# Altium project Fall22 Universal PCB Rev.2.PrjPcb (part 2 of 2)
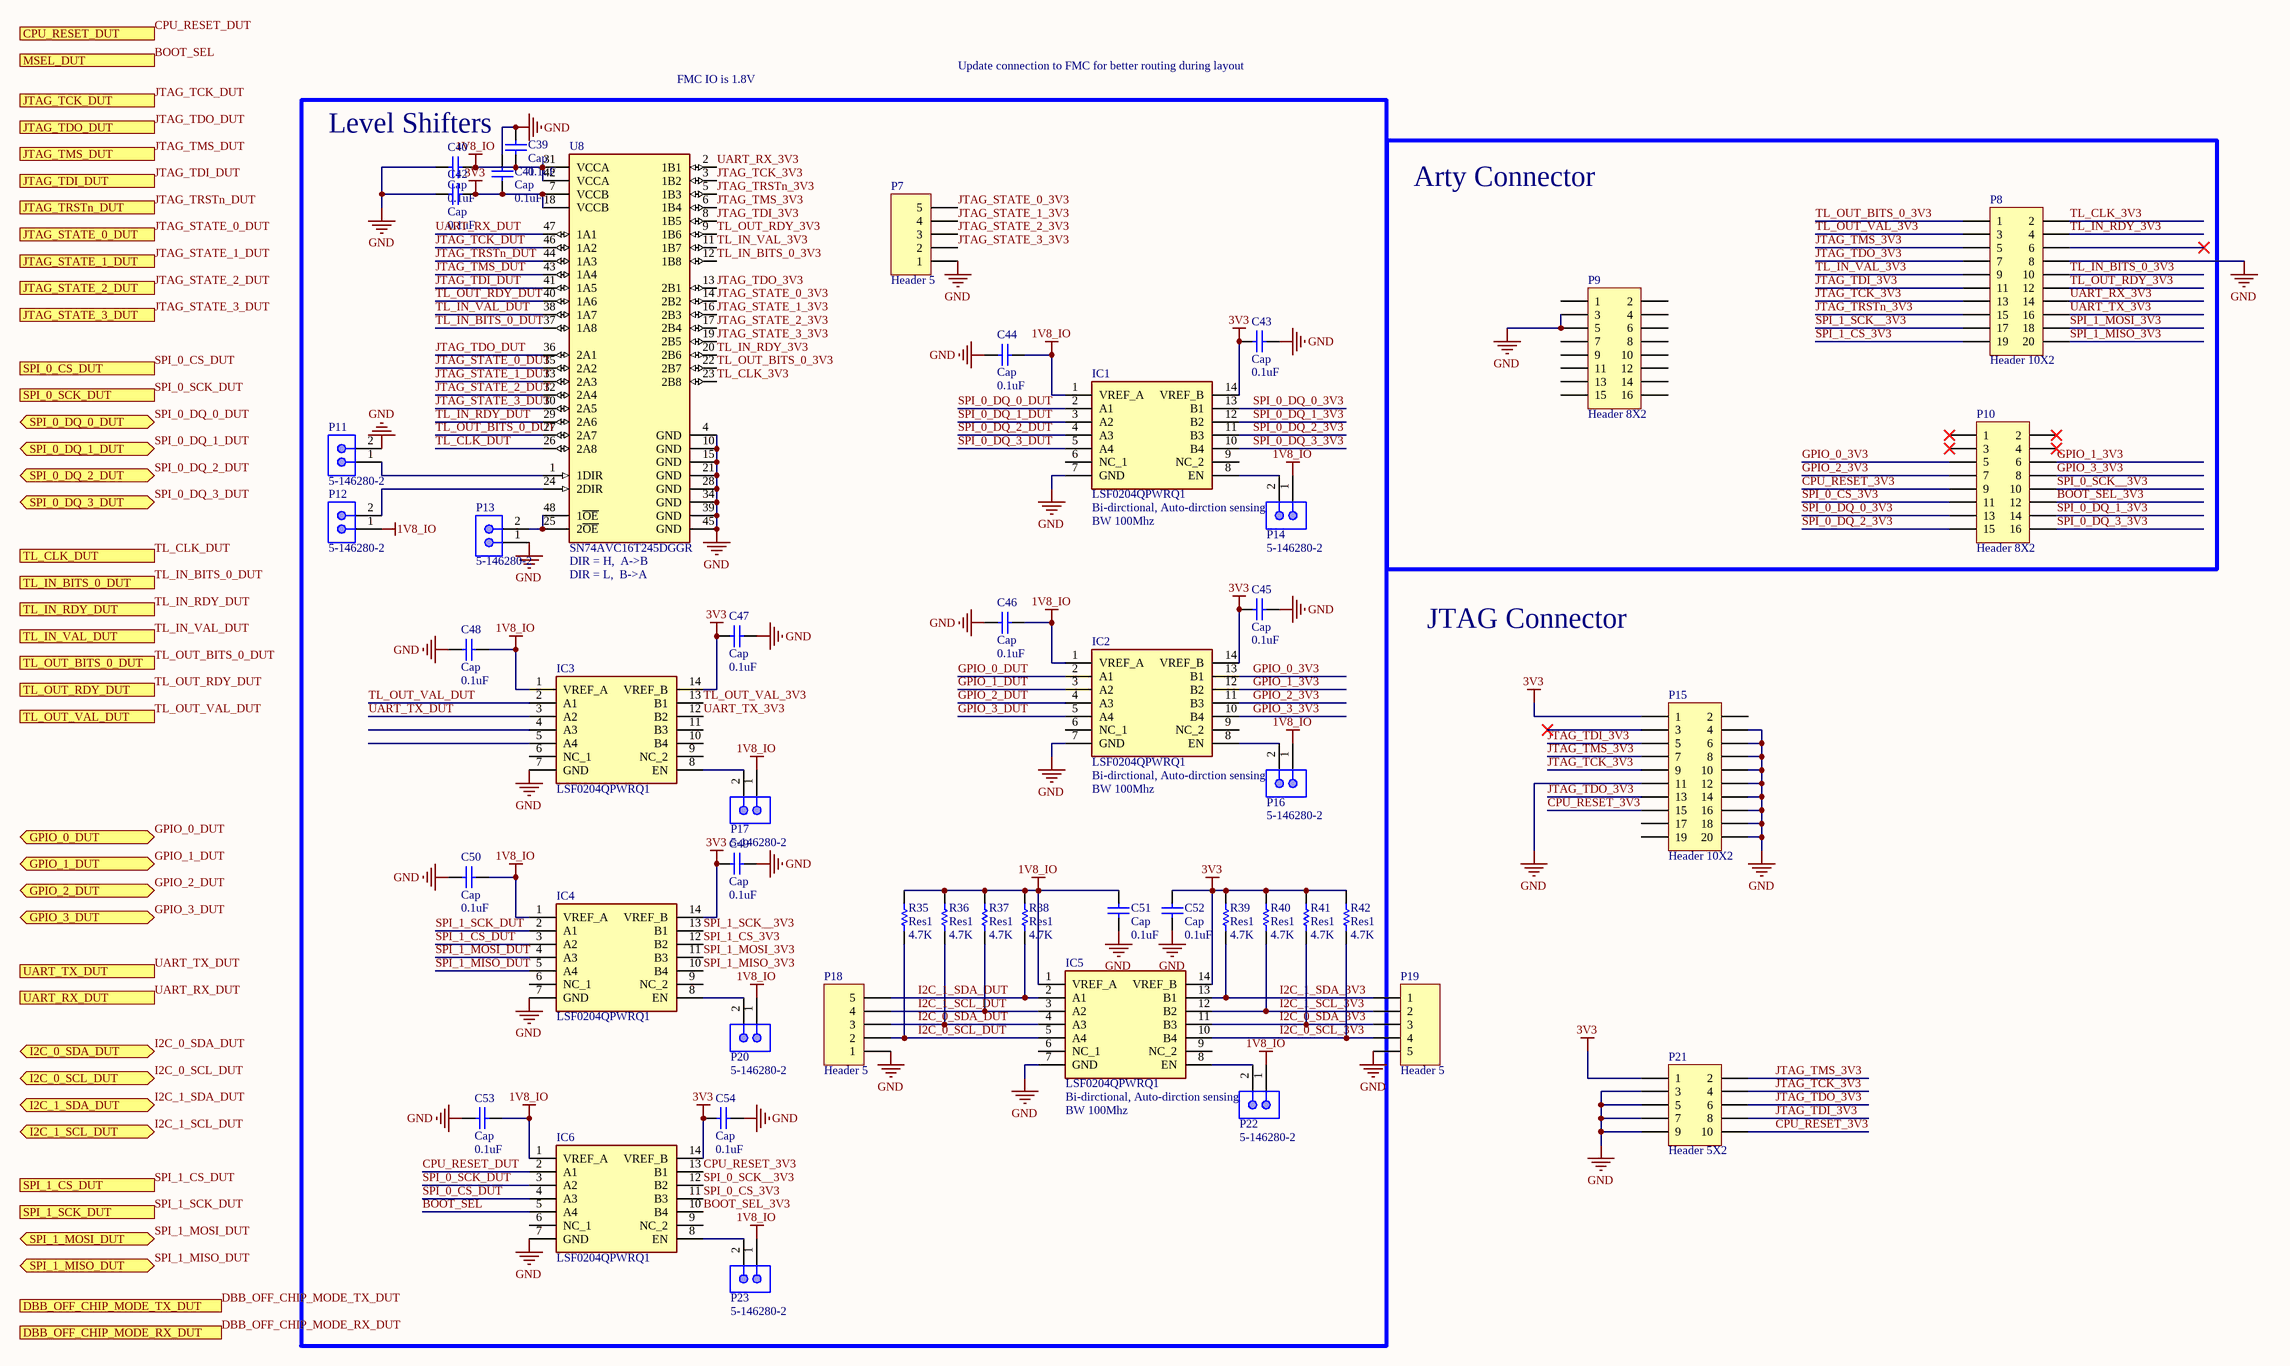
[diagram p8: IO.SchDoc]

## Nets that join several sheets
1V8_DUT: DUT (16 pins), Power (5 pins)
1V8_IO: Power (P6.2), IO (27 pins)
3V3: Power (17 pins), IO (22 pins)
GND: DUT (273 pins), Power (62 pins), IO (52 pins)
VDD_BATT: DUT (30 pins), Power (C22.1 C23.1 C24.1 P4.2)
VDD_DCO: DUT (*2.7), Power (5 pins)
BOOT_SEL: DUT (*2.280 P24.7 P26.2 R52.1), IO (IC6.5)
CPU_RESET: DUT (*1.1 *2.316 P24.8 R76.1), IO (IC6.2)
GPIO_0: DUT (*2.319 P25.1 R43.1), IO (IC2.2)
GPIO_1: DUT (*2.301 P25.2 R44.1), IO (IC2.3)
GPIO_2: DUT (*2.283 P25.3 R45.1), IO (IC2.4)
GPIO_3: DUT (*2.50 P25.4 R46.1), IO (IC2.5)
I2C_0_SCL: DUT (*2.30 J6.G2), IO (IC5.5 P18.2 R35.1)
I2C_0_SDA: DUT (*2.14 J6.G3), IO (IC5.4 P18.3 R36.1)
I2C_1_SCL: DUT (*2.281 R50.1), IO (IC5.3 P18.4 R37.1)
I2C_1_SDA: DUT (*2.282 R47.1), IO (IC5.2 P18.5 R38.1)
JTAG_STATE_0: DUT (*2.318 P24.3 R48.1), IO (U8.35)
JTAG_STATE_1: DUT (*2.298 P24.9 R54.1), IO (U8.33)
JTAG_STATE_2: DUT (*2.300 P24.4 R49.1), IO (U8.32)
JTAG_STATE_3: DUT (*2.317 P24.6 R51.1), IO (U8.30)
JTAG_TCK: DUT (*2.42 P24.27 R71.1), IO (U8.46)
JTAG_TDI: DUT (*2.5 P24.23 R67.1), IO (U8.41)
JTAG_TDO: DUT (*2.41 P24.24 R68.1), IO (U8.36)
JTAG_TMS: DUT (*2.6 P24.25 R69.1), IO (U8.43)
JTAG_TRST: DUT (*2.24 P24.26 R70.1), IO (U8.44)
SPI_0_CS: DUT (*2.279 P24.10 R55.1), IO (IC6.4)
SPI_0_DQ_0_DUT: DUT (*2.315 P24.11 R56.1), IO (IC1.2)
SPI_0_DQ_1_DUT: DUT (*2.278 P24.13 R58.1), IO (IC1.3)
SPI_0_DQ_2_DUT: DUT (*2.297 P24.12 R57.1), IO (IC1.4)
SPI_0_DQ_3_DUT: DUT (*2.314 P24.14 R59.1), IO (IC1.5)
SPI_0_SCK: DUT (*2.313 P24.15 R53.1), IO (IC6.3)
SPI_1_CS: DUT (*2.31 J7.2 R78.1), IO (IC4.3)
SPI_1_MISO: DUT (*2.13 J7.4 R80.1), IO (IC4.5)
SPI_1_MOSI: DUT (*2.49 J7.3 R79.2), IO (IC4.4)
SPI_1_SCK: DUT (*2.48 J7.1 R77.1), IO (IC4.2)
TL_CLK: DUT (P24.16 R60.1 R86.2), IO (U8.26)
TL_IN_BITS_0_DUT: DUT (P24.17 R61.1 R84.2), IO (U8.37)
TL_IN_RDY: DUT (P24.19 R63.1 R85.2), IO (U8.29)
TL_IN_VAL: DUT (P24.20 R64.1 R83.2), IO (U8.38)
TL_OUT_BITS_0_DUT: DUT (P24.18 R62.1 R82.2), IO (U8.27)
TL_OUT_RDY: DUT (P24.22 R66.1 R88.2), IO (U8.40)
TL_OUT_VAL: DUT (P24.21 R65.1 R87.2), IO (IC3.2)
UART_RX: DUT (*2.43 P24.29 R73.1), IO (U8.47)
UART_TX: DUT (*2.25 P24.28 R72.1), IO (IC3.3)